# Altium schematic sheet IGBT Current Control.SchDoc
size 406 x 304 mm; SheetNumber: 4; SheetTotal: 14
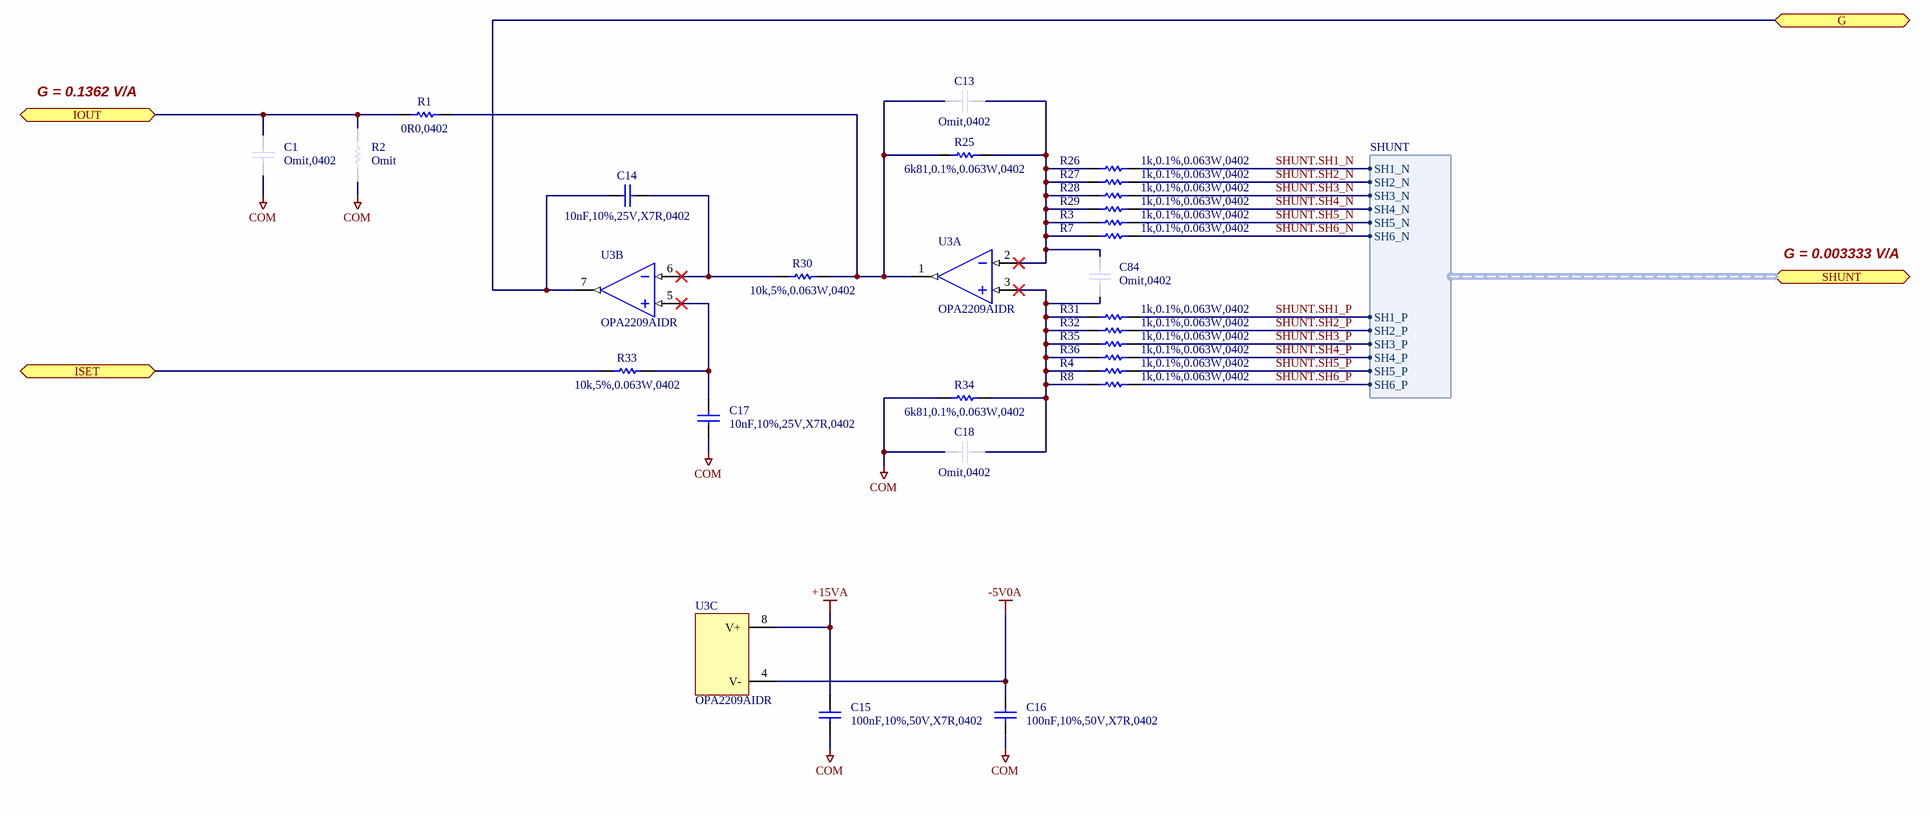
[diagram p0: IGBT Current Control.SchDoc]

## Parts
C1  Omit,0402  [CAPC1005X06N]  (no BOM)
C13  Omit,0402  [CAPC1005X06N]  (no BOM)
C14  10nF,10%,25V,X7R,0402  [CAPC1005X06N]
C15  100nF,10%,50V,X7R,0402  [CAPC1005X06N]
C16  100nF,10%,50V,X7R,0402  [CAPC1005X06N]
C17  10nF,10%,25V,X7R,0402  [CAPC1005X06N]
C18  Omit,0402  [CAPC1005X06N]  (no BOM)
C84  Omit,0402  [CAPC1005X06N]  (no BOM)
R1  0R0,0402  [RESC1005X04N]
R2  Omit  [RESC1005X04N]  (no BOM)
R3  1k,0.1%,0.063W,0402  [RESC1005X04N]
R4  1k,0.1%,0.063W,0402  [RESC1005X04N]
R7  1k,0.1%,0.063W,0402  [RESC1005X04N]
R8  1k,0.1%,0.063W,0402  [RESC1005X04N]
R25  6k81,0.1%,0.063W,0402  [RESC1005X04N]
R26  1k,0.1%,0.063W,0402  [RESC1005X04N]
R27  1k,0.1%,0.063W,0402  [RESC1005X04N]
R28  1k,0.1%,0.063W,0402  [RESC1005X04N]
R29  1k,0.1%,0.063W,0402  [RESC1005X04N]
R30  10k,5%,0.063W,0402  [RESC1005X04N]
R31  1k,0.1%,0.063W,0402  [RESC1005X04N]
R32  1k,0.1%,0.063W,0402  [RESC1005X04N]
R33  10k,5%,0.063W,0402  [RESC1005X04N]
R34  6k81,0.1%,0.063W,0402  [RESC1005X04N]
R35  1k,0.1%,0.063W,0402  [RESC1005X04N]
R36  1k,0.1%,0.063W,0402  [RESC1005X04N]
U3  OPA2209AIDR  [TEXASINSTRUMENTS_PKG_D0008A]  (parts A,B,C of 3)

## Ports
G (bidir), IOUT (bidir), ISET (bidir), SHUNT (bidir, harness SHUNT)

## Harnesses
SHUNT: SH1_P, SH1_N, SH2_P, SH2_N, SH3_P, SH3_N, SH4_P, SH4_N, SH5_N, SH5_P, SH6_N, SH6_P

## Nets
+15VA: C15.2 U3.8(V+)
-5V0A: C16.2 U3.4(V-)
COM: C1.1 C15.1 C16.1 C17.1 C18.1 R2.1 R34.1
G: C14.2 U3.7(OUTB) ; port G
IOUT: C1.2 R1.1 R2.2 ; port IOUT
ISET: R33.1 ; port ISET
SHUNT.SH1_N: R26.2 ; port SHUNT.SH1_N
SHUNT.SH1_P: R31.2 ; port SHUNT.SH1_P
SHUNT.SH2_N: R27.2 ; port SHUNT.SH2_N
SHUNT.SH2_P: R32.2 ; port SHUNT.SH2_P
SHUNT.SH3_N: R28.2 ; port SHUNT.SH3_N
SHUNT.SH3_P: R35.2 ; port SHUNT.SH3_P
SHUNT.SH4_N: R29.2 ; port SHUNT.SH4_N
SHUNT.SH4_P: R36.2 ; port SHUNT.SH4_P
SHUNT.SH5_N: R3.2 ; port SHUNT.SH5_N
SHUNT.SH5_P: R4.2 ; port SHUNT.SH5_P
SHUNT.SH6_N: R7.2 ; port SHUNT.SH6_N
SHUNT.SH6_P: R8.2 ; port SHUNT.SH6_P
NetC13_1: C13.1 R1.2 R25.1 R30.2 U3.1(OUTA)
NetC13_2: C13.2 C84.2 R3.1 R7.1 R25.2 R26.1 R27.1 R28.1 R29.1 U3.2(-INA)
NetC14_1: C14.1 R30.1 U3.6(-INB)
NetC17_2: C17.2 R33.2 U3.5(+INB)
NetC18_2: C18.2 C84.1 R4.1 R8.1 R31.1 R32.1 R34.2 R35.1 R36.1 U3.3(+INA)

## Notes on the sheet
- G = 0.1362 V/A
- G = 0.003333 V/A
- Rev
- Sheet Name:
- Date:
- Sheet
- Designer:
- of

## Library data of the parts
C1 C13 C18 C84 = CAP,Omit,0402: Omit; Part Name: CAP,Omit,0402; CreatedBy: Judd Foster; HelpURL: N/A; Manufacturer 1: N/A; Manufacturer 1 Part Number: N/A; Vendor 1: N/A; Vendor 1 Part Number: N/A; Value: Omit
C14 C17 = CAP,Cer,10nF,10%,25V,X7R,0402: 10000pF ï¿½10% 25V Ceramic Capacitor X7R 0402 (1005 Metric); Manufacturer 1: Murata Electronics; Manufacturer 1 Part Number: GCM155R71E103KA37D; Vendor 1 Part Number: 490-6043-1-ND; Vendor 1: Digikey; Value: 10n; Part Name: CAP,Cer,10nF,10%,25V,X7R,0402; CreatedBy: Judd Foster; HelpURL: https://psearch.en.murata.com/capacitor/product/GCM155R71E103KA37%23.pdf
C15 C16 = CAP,Cer,100nF,10%,50V,X7R,0402: 50V 100nF X7R Â±10% 0402 Ceramic Capacitors ROHS; Manufacturer 1: Murata; Manufacturer 1 Part Number: GRM155R71H104KE14D; Vendor 1 Part Number: C77020; Vendor 1: LCSC; Value: 100n; Part Name: CAP,Cer,100nF,10%,50V,X7R,0402; CreatedBy: Judd Foster; HelpURL: https://www.lcsc.com/datasheet/C77020.pdf
R1 = RES,0R0,0402: 0 Ohms Jumper 0.1W, 1/10W Chip Resistor 0402 (1005 Metric) Automotive AEC-Q200 Thick Film; Manufacturer 1: Panasonic Electronic Components; Manufacturer 1 Part Number: ERJ-2GE0R00X; Vendor 1 Part Number: P0.0JCT-ND; Vendor 1: Digikey; Value: 0; Part Name: RES,0R0,0402; CreatedBy: Judd Foster; HelpURL: https://industrial.panasonic.com/cdbs/www-data/pdf/RDA0000/AOA0000C301.pdf
R2 = RES,Omit,0402: Part Name: RES,Omit,0402; CreatedBy: Judd Foster; HelpURL: N/A; Manufacturer 1: N/A; Manufacturer 1 Part Number: N/A; Vendor 1: N/A; Vendor 1 Part Number: N/A; Value: Omit
R3 R4 R7 R8 R26-R29 R31 R32 R35 R36 = RES,1k,0.1%,0.063W,0402: 1 kOhms Â±0.1% 0.063W, 1/16W Chip Resistor 0402 (1005 Metric) Thin Film; Manufacturer 1: YAGEO; Manufacturer 1 Part Number: RT0402BRE071KL; Vendor 1 Part Number: YAG2306CT-ND; Vendor 1: DigiKey; Part Name: RES,1k,0.1%,0.063W,0402; CreatedBy: Judd Foster; HelpURL: https://www.yageo.com/upload/media/product/app/datasheet/rchip/pyu-rt_1-to-0.01_rohs_l.pdf; Value: 1k
R25 R34 = RES,6k81,0.1%,0.063W,0402: 6.81kÎ© 62.5mW 50V Â±25ppm/â„ƒ Thin Film Resistor Â±0.1% 0402 Chip Resistor - Surface Mount RoHS; Manufacturer 1: YAGEO; Manufacturer 1 Part Number: AT0402BRD076K81L; Vendor 1 Part Number: C851098; Vendor 1: LCSC; Part Name: RES,6k81,0.1%,0.063W,0402; CreatedBy: Judd Foster; HelpURL: https://www.lcsc.com/datasheet/C851098.pdf; Value: 6k81
R30 R33 = RES,10k,5%,0.063W,0402: 10 kOhms ï¿½5% 0.063W, 1/16W Chip Resistor 0402 (1005 Metric) Automotive AEC-Q200 Thick Film; Manufacturer 1: Stackpole Electronics Inc; Manufacturer 1 Part Number: RMCF0402JT10K0; Vendor 1 Part Number: RMCF0402JT10K0CT-ND; Vendor 1: DIgikey; Part Name: RES,10k,5%,0.063W,0402; CreatedBy: Judd Foster; HelpURL: https://www.seielect.com/catalog/sei-rmcf_rmcp.pdf; Value: 10k
U3 = OPA2209AIDR: 35uV 18MHz 4.5nA 6.4V/us 130dB SOIC-8 Amplifiers ROHS; Manufacturer 1: Texas Instruments; Vendor 1 Part Number: C2057330; Vendor 1: LCSC; Part Name: OPA2209AIDR; CreatedBy: Judd Foster; HelpURL: https://www.lcsc.com/datasheet/C2057330.pdf; Manufacturer 1 Part Number: OPA2209AIDR